# EAGLE design xbee_module_jan2022 (EAGLE 9.6.2)
COMPANY: Adafruit Industries; DRAWN: KTOWN; REV: A

## Sheet 1 of 2
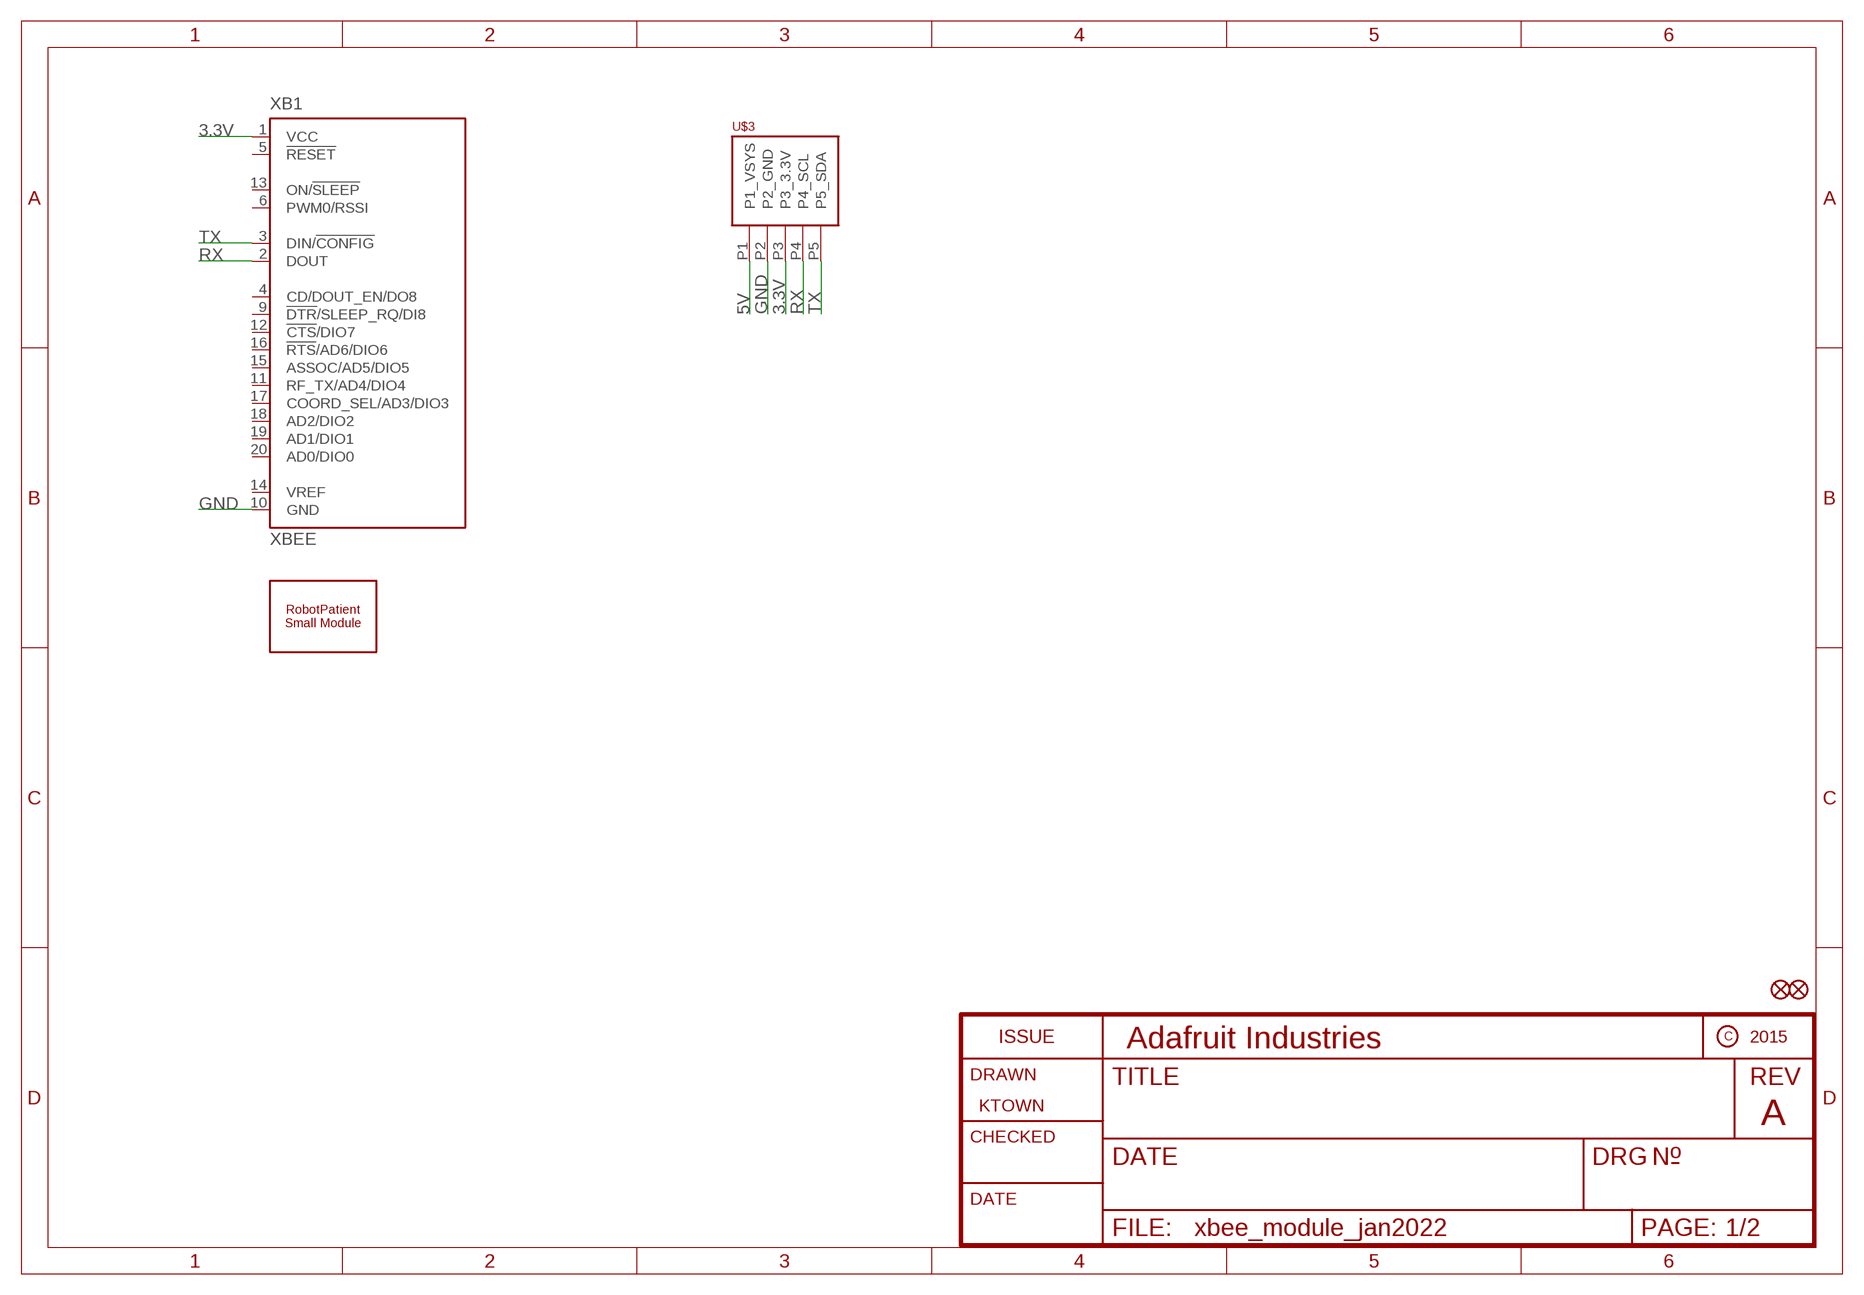
[diagram p0: schematic, sheet 1]

### Parts
FID1  FIDUCIAL""  [FIDUCIAL_1MM]
FID2  FIDUCIAL""  [FIDUCIAL_1MM]
U$2  ROBOTPATIENT_SMALL_MODULEBOARD  [RP_SMALL_SENSOR_OUTLINE]
U$3  PHOENIX_PTSM_M5_THUART  [PTSM_M5_TH_UART]
XB1  XBEE  [XBEE]

### Nets
3.3V: U$3.P3(P3_3.3V) XB1.1(VCC) ; also sheet 2
5V: U$3.P1(P1_VSYS) ; also sheet 2
GND: U$3.P2(P2_GND) XB1.10(GND) ; also sheet 2
RX: U$3.P4(P4_SCL) XB1.2(DOUT)
TX: U$3.P5(P5_SDA) XB1.3(DIN/!CONFIG)
Unconnected: XB1.4(CD/DOUT_EN/DO8) XB1.5(!RESET) XB1.6(PWM0/RSSI) XB1.9(!DTR!/SLEEP_RQ/DI8) XB1.11(RF_TX/AD4/DIO4) XB1.12(!CTS!/DIO7) XB1.13(ON/!SLEEP) XB1.14(VREF) XB1.15(ASSOC/AD5/DIO5) XB1.16(!RTS!/AD6/DIO6) XB1.17(COORD_SEL/AD3/DIO3) XB1.18(AD2/DIO2) XB1.19(AD1/DIO1) XB1.20(AD0/DIO0)

## Sheet 2 of 2: Power
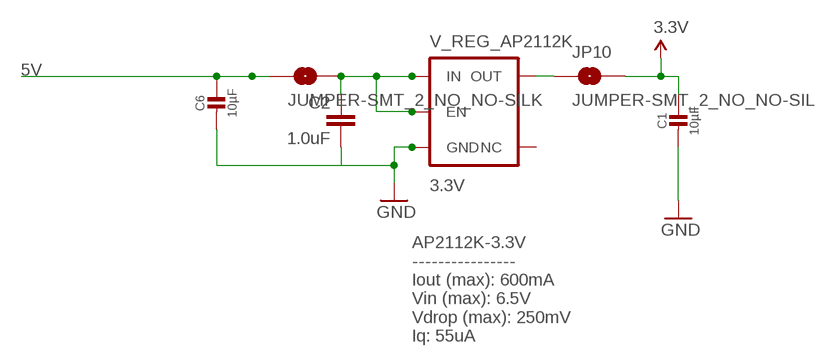
[diagram p1: schematic, sheet 2]

### Parts
C1  10µF  CAP_CERAMIC0805-NOOUTLINE  [0805-NO]
C2  1.0uF  1.0UF-25V-+80/-20(0805)"  [0805-CAP]
C6  10µF  CAP_CERAMIC0805-NOOUTLINE  [0805-NO]
JP10  JUMPER-SMT_2_NO_NO-SILK  [SMT-JUMPER_2_NO_NO-SILK]
JP11  JUMPER-SMT_2_NO_NO-SILK  [SMT-JUMPER_2_NO_NO-SILK]
V_REG_AP2112K  3.3V  V_REG_AP2112K-3.3V  [SOT23-5]

### Nets
3.3V: C1.1 JP10.2 ; also sheet 1
5V: C6.1 JP11.1 ; also sheet 1
GND: C1.2 C2.2 C6.2 V_REG_AP2112K.2(GND) ; also sheet 1
N$9: JP10.1 V_REG_AP2112K.5(OUT)
N$13: C2.1 JP11.2 V_REG_AP2112K.1(IN) V_REG_AP2112K.3(EN)
Unconnected: V_REG_AP2112K.4(NC)

### Notes on the sheet
- AP2112K-3.3V
  ----------------
  Iout (max): 600mA 
  Vin (max): 6.5V
  Vdrop (max): 250mV
  Iq: 55uA

## Library data of the parts
C1 C6 = microbuilder:CAP_CERAMIC: Ceramic Capacitors For new designs, use the packages preceded by an '_' character since they are more reliable: The following footprints should be used on most boards: _0402 - Standard footprint for regular board layouts _0603 - Standard footprint for regular board layouts _0805 - Standard footprint for regular board layouts _1206 - Standard footprint for regular board layouts For extremely tight-pitch boards where space is at a premium, the following 'micro-pitch' footprints can be used (smaller pads, no silkscreen outline, etc.): _0402MP - Micro-pitch footprint for very dense/compact boards _0603MP - Micro-pitch footprint for very dense/compact boards _0805MP - Micro-pitch footprint for very dense/compact boards _1206MP - Micro-pitch footprint for very dense/compact boards
C2 = SparkFun-Capacitors:1.0UF-25V-+80/-20(0805): CAP-11625; PROD_ID: CAP-11625
FID1 FID2 = microbuilder:FIDUCIAL: Fiducial Alignment Points Various fiducial points for machine vision alignment.; BOM: EXCLUDE
JP10 JP11 = SparkFun-Jumpers:JUMPER-SMT_2_NO: Normally open jumper This jumper has two pads in close proximity to each other. Apply solder to close the connection. Round pads are easier to solder for beginners, but are a lot larger. SparkFun Product that uses the round pads: SparkFun EL Sequencer <https://www.sparkfun.com/products/12781>
U$2 = jk_customs:ROBOTPATIENT_SMALL_MODULE
U$3 = jk_customs:PHOENIX_PTSM_M5_TH: Datasheet Phoenix PTSM 0,5/ 5-HH-2,5-THR R32 <https://www.phoenixcontact.com/online/portal/us?uri=pxc-oc-itemdetail:pid=1778654&library=usen&pdfmode=direct&pdflanguage=en>
V_REG_AP2112K = SparkFun-PowerIC:V_REG_AP2112: AP2112 - 600mA CMOS LDO Regulator w/ Enable The AP2112 is CMOS process low dropout linear regulator with enable function, the regulator delivers a guaranteed 600mA (min.) continuous load current. Features Output Voltage Accuracy: ±1.5% Output Current: 600mA (Min.) Foldback Short Current Protection: 50mA Enable Function to Turn ON/OFF VOUT Low Dropout Voltage (3.3V): 250mV (Typ.) @IOUT=600mA Excellent Load Regulation: 0.2%/A (Typ.) Excellent Line Regulation: 0.02%/V (Typ.) Low Quiescent Current: 55μA (Typ.) Low Standby Current: 0.01μA (Typ.) Low Output Noise: 50μVRMS PSRR: 100Hz -65dB, 1kHz -65dB OTSD Protection Stable with 1.0μF Flexible Cap: Ceramic, Tantalum and Aluminum Electrolytic Operation Temperature Range: -40°C to 85°C ESD: MM 400V, HBM 4000V; PROD_ID: VREG-12457
XB1 = maxstream:XBEE: XBee (TM) /XBee-PRO(TM) OEM RF Modules Source: MaxStream, Inc. xbee_productmanual.pdf; MPN: XBP24-Z7UIT-004; OC_FARNELL: 1751799; OC_NEWARK: 34R5507

## Net classes
1 power: width 0.305 mm
2 gnd: width 0.254 mm

## Board
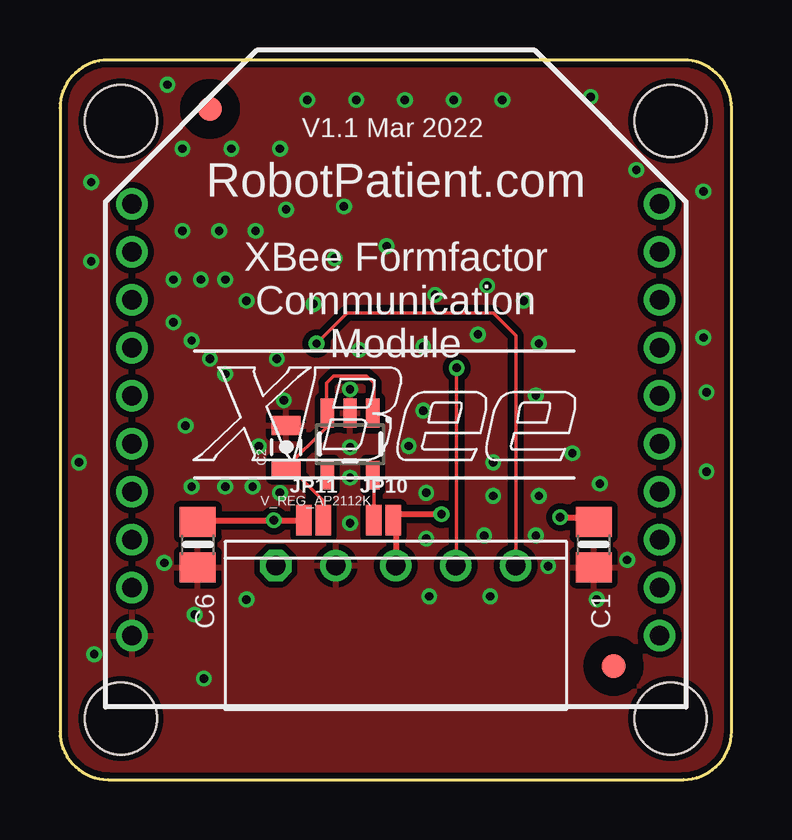
[diagram p2: board, top side]
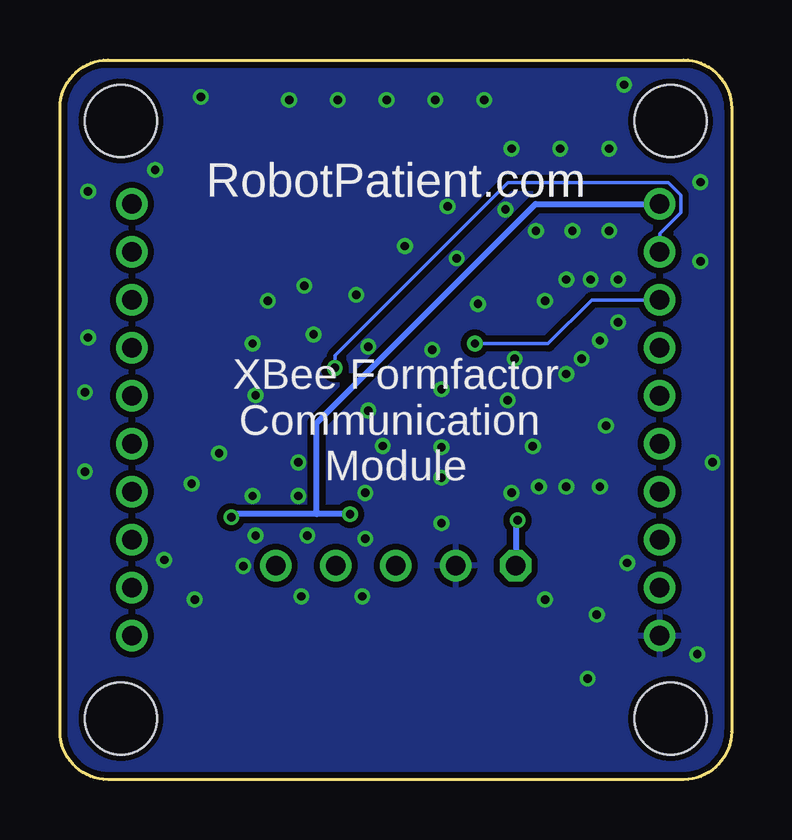
[diagram p3: board, bottom side, seen from below]

Size 28 x 30 mm. Coordinates in mm from the lower left corner, seen from the top.
Copper layers (1*16): Top 0.035mm / dielectric 1.5mm / Bottom 0.035mm
Design rules "SeeedStudio_2layer_DRU_no_angle_20140221": minimum track width 6mil, minimum drill 12mil, track to track 6mil, track to pad 6mil, pad to pad 6mil, via to via 6mil, smd to smd 0mil, copper to edge 10mil, drill to drill 10mil, minimum pad ring 10mil, minimum via ring 6mil, stop-mask expansion 2mil, vias tented up to drill 100mil, thermal gap 10mil

### Footprints (pad centres in the part's own frame; a part is rotated, then mirrored left to right if it is on the bottom)
0805-NO = smd 1.24 x 1.5: 1 -0.95,0; 2 0.95,0
0805-CAP = smd 0.8 x 1.2: 1 -0.9,0; 2 0.9,0
FIDUCIAL_1MM = smd 1 x 1: 1 0,0
SMT-JUMPER_2_NO_NO-SILK = smd 0.635 x 1.27: 1 -0.406,0; 2 0.406,0
RP_SMALL_SENSOR_OUTLINE = hole 3: -11.455,12.455; 11.455,12.455; 11.455,-12.455; -11.455,-12.455
PTSM_M5_TH_UART = drill 0.8 octagon: P1 5,-0.27 | drill 0.8: P2 2.5,-0.27; P3 0,-0.27; P4 -2.5,-0.27; P5 -5,-0.27
SOT23-5 = smd 0.55 x 1.2: 1 -0.95,-1.3; 2 0,-1.3; 3 0.95,-1.3; 4 0.95,1.3; 5 -0.95,1.3
XBEE = drill 0.8 pad 1.27: 1 -11,9; 2 -11,7; 3 -11,5; 4 -11,3; 5 -11,1; 6 -11,-1; 7 -11,-3; 8 -11,-5; 9 -11,-7; 10 -11,-9; 11 11,-9; 12 11,-7; 13 11,-5; 14 11,-3; 15 11,-1; 16 11,1; 17 11,3; 18 11,5; 19 11,7; 20 11,9

### Placement (x,y rotation side)
C1  22.26,9.79 270 top
C2  9.43,13.86 90 top
C6  5.74,9.79 270 top
FID1  6.25,27.96 0 top
FID2  23.08,4.74 0 top
JP10  13.49,10.81 0 top
JP11  10.57,10.81 0 top
U$2  14,15 0 top
U$3  14,8.65 180 top
V_REG_AP2112K  12.1,13.98 180 top
XB1  14,15 0 top

### Tracks (layer width: path | path; a pad name or v marks a point on that pad's centre or on a via)
3.3V  (via drill 0.35)
  Top 0.254: U$3.P3 14,10.71 JP10.2 14.15,11.06 v15.9,11.06 | v20.86,10.94 22.06,10.94 C1.1
  Bottom 0.254: v15.9,11.06 17.3,11.06 | 17.3,11.06 20.73,11.06 v20.86,10.94 | 17.3,11.06 17.3,14.87 8.18,24 XB1.1
5V  (via drill 0.35)
  Top 0.152: C6.1 5.81,10.81
  Top 0.254: 5.81,10.81 v8.92,10.81 JP11.1
  Bottom 0.254: v8.92,10.81 9,10.73 U$3.P1
GND  (via drill 0.35)
  other vias: 5.11,22.87 9.43,23.76 11.46,21.73 15.14,18.05 6.63,22.87 8.16,22.87 4.73,19.06 4.73,20.84 1.3,21.6 1.3,24.91 5.11,26.3 7.14,26.3 9.17,26.3 5.87,20.84 6.89,20.84 7.78,19.95 5.49,18.3 6.25,17.54 6.89,16.91 18.06,11.82 15.27,11.95 19.97,11.82 18.06,13.22 21.37,13.6 20.35,8.9 17.94,7.63 15.4,7.63 7.78,7.51 22.38,7.51 22.51,12.33 23.65,9.16 5.49,12.21 4.35,9.03 5.62,6.87 10.57,19.83 12.48,17.92 9.05,17.54 17.43,18.56 17.81,20.59 19.97,18.18 17.68,10.17 15.27,10.05 19.84,10.17 12.1,10.68 12.1,13.86 12.1,12.59 12.1,16.27 15.14,15.38 6.89,12.21 26.83,18.43 26.95,16.14 26.95,12.84 26.83,24.52 24.03,25.41 22.13,28.46 4.47,28.97 10.32,28.34 12.35,28.34 14.38,28.34 16.41,28.34 18.45,28.34 11.84,23.89 13.62,22.24 15.65,20.21 19.33,19.95 19.84,16.02 5.24,14.75 0.79,13.22 1.43,5.22 6,4.21 8.03,12.21 9.17,11.95 8.29,13.9 9.34,15.81 14.55,13.91
  pour Top (isolate 0.254): -3.78,-1.89 -3.78,32.02 30.38,32.02 30.38,-1.89
  pour Bottom (isolate 0.254): -2,-2.4 -2,30.37 31.02,30.37 31.02,-2.4
N$9
  Top 0.152: JP10.1 13.09,12.56 V_REG_AP2112K.5
N$13
  Top 0.152: V_REG_AP2112K.1 13.09,15.3 13.09,16.52 12.78,16.83 11.41,16.83 11.1,16.52 11.1,15.3 V_REG_AP2112K.3 11.1,15.15 11.1,14.68 9.43,13.01 C2.1 | 9.73,12.87 9.43,12.87 C2.1 | 9.73,12.87 10.95,11.65 10.95,10.88 JP11.2 | 9.73,12.87 C2.1
RX  (via drill 0.35)
  Top 0.152: v16.54,17.16 16.54,9 16.5,9 U$3.P4
  Bottom 0.152: XB1.2 3,22.75 2.12,23.63 2.12,24.37 2.63,24.88 9.32,24.88 16.54,17.67 v16.54,17.16
TX  (via drill 0.35)
  Top 0.152: U$3.P5 19,18.51 18.06,19.45 11.97,19.45 v10.7,18.18
  Bottom 0.152: v10.7,18.18 7.65,18.18 5.82,20 XB1.3

### Text on the board
tSilk: RobotPatient.com | XBee Formfactor / Communication / Module
bSilk: RobotPatient.com | XBee Formfactor / Communication / Module